# Altium project 2312_BadgePlaceTravail.PrjPcb (part 2 of 2)
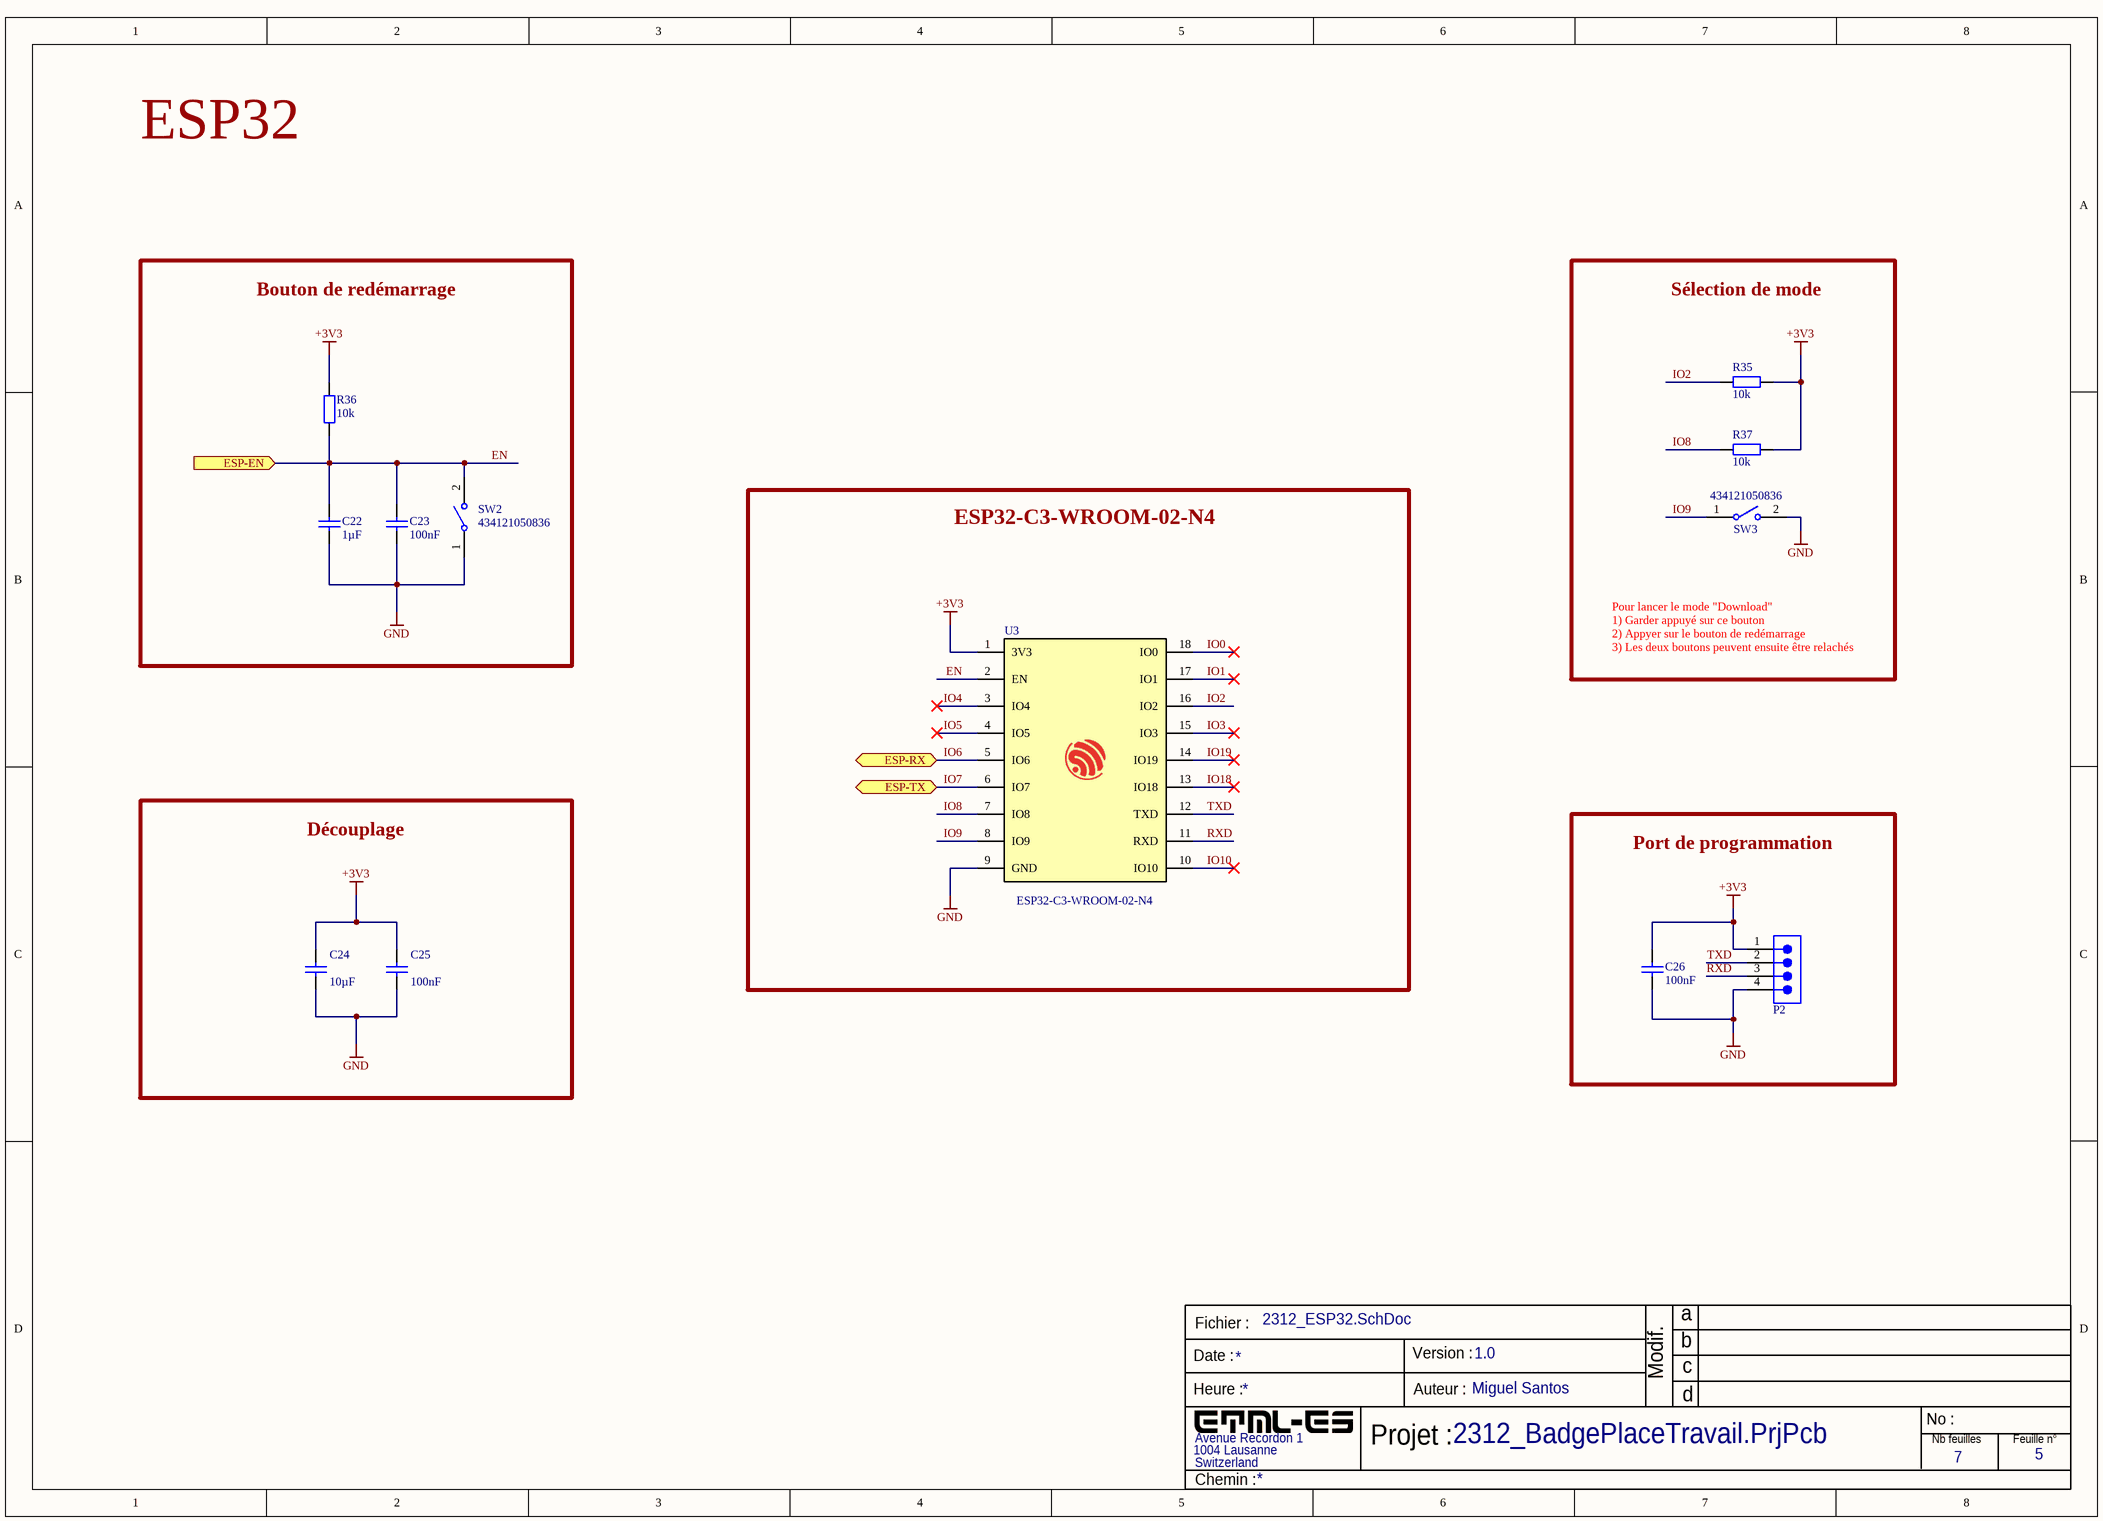
[diagram p7: 2312_ESP32.SchDoc]

## Nets that join several sheets
+3V3: 2312_SchemaBloc (P4.2 TP1.1), 2312_Puissance (5 pins), 2312_PIC32 (15 pins), 2312_Interface (11 pins), 2312_Ethernet (24 pins), 2312_RFID (C27.2 C28.2 MIKROBUS1.7 P3.1), 2312_ESP32 (8 pins)
GND: 2312_SchemaBloc (TP3.1 TP4.1), 2312_Puissance (7 pins), 2312_PIC32 (15 pins), 2312_Interface (13 pins), 2312_Ethernet (16 pins), 2312_RFID (5 pins), 2312_ESP32 (9 pins)
AC-RST: 2312_Puissance (R3.2), 2312_PIC32 (U1.58)
AC-SET: 2312_Puissance (R4.1), 2312_PIC32 (U1.59)
CHILLI-RX: 2312_SchemaBloc (P6.1), 2312_PIC32 (U1.32), 2312_RFID (P3.3)
CHILLI-TX: 2312_SchemaBloc (P6.2), 2312_PIC32 (U1.31), 2312_RFID (P3.2)
CRS_DV: 2312_PIC32 (U1.62), 2312_Ethernet (R26.2)
DEBUG: 2312_SchemaBloc (TP2.1), 2312_PIC32 (U1.8), 2312_Interface (R45.1)
EMDC: 2312_PIC32 (U1.30), 2312_Ethernet (U2.13)
EMDIO: 2312_PIC32 (U1.49), 2312_Ethernet (R13.1 U2.12)
EN: 2312_PIC32 (U1.53), 2312_ESP32 (5 pins)
EREF-CLK: 2312_PIC32 (U1.63), 2312_Ethernet (R34.1)
ERXD_0: 2312_PIC32 (U1.61), 2312_Ethernet (R24.2)
ERXD_1: 2312_PIC32 (U1.60), 2312_Ethernet (R25.2)
ERXERR: 2312_PIC32 (U1.64), 2312_Ethernet (R30.2 U2.10)
ETXD_0: 2312_PIC32 (U1.2), 2312_Ethernet (R18.2)
ETXD_1: 2312_PIC32 (U1.3), 2312_Ethernet (R23.2)
ETXEN: 2312_PIC32 (U1.1), 2312_Ethernet (R27.2)
INT4: 2312_PIC32 (U1.45), 2312_Ethernet (R14.1 U2.14)
IO6: 2312_SchemaBloc (P8.2), 2312_PIC32 (U1.50), 2312_ESP32 (U3.5)
IO7: 2312_SchemaBloc (P8.1), 2312_PIC32 (U1.51), 2312_ESP32 (U3.6)
MB-AN: 2312_SchemaBloc (P9.1), 2312_PIC32 (U1.13), 2312_RFID (MIKROBUS1.1)
MB-CS: 2312_SchemaBloc (P10.4), 2312_PIC32 (U1.14), 2312_RFID (MIKROBUS1.3)
MB-INT: 2312_SchemaBloc (P9.4), 2312_PIC32 (U1.11), 2312_RFID (MIKROBUS1.15)
MB-MISO: 2312_SchemaBloc (P10.2), 2312_PIC32 (U1.5), 2312_RFID (MIKROBUS1.5)
MB-MOSI: 2312_SchemaBloc (P10.1), 2312_PIC32 (U1.6), 2312_RFID (MIKROBUS1.6)
MB-PWM: 2312_SchemaBloc (P9.2), 2312_PIC32 (U1.12), 2312_RFID (MIKROBUS1.16)
MB-RST: 2312_SchemaBloc (P9.3), 2312_PIC32 (U1.17), 2312_RFID (MIKROBUS1.2)
MB-RX: 2312_SchemaBloc (P7.1), 2312_PIC32 (U1.29), 2312_RFID (MIKROBUS1.14)
MB-SCK: 2312_SchemaBloc (P10.3), 2312_PIC32 (U1.4), 2312_RFID (MIKROBUS1.4)
MB-SCL: 2312_SchemaBloc (P7.3), 2312_PIC32 (R10.2 U1.44), 2312_RFID (MIKROBUS1.12)
MB-SDA: 2312_SchemaBloc (P7.4), 2312_PIC32 (R9.1 U1.43), 2312_RFID (MIKROBUS1.11)
MB-TX: 2312_SchemaBloc (P7.2), 2312_PIC32 (U1.21), 2312_RFID (MIKROBUS1.13)
nRST: 2312_PIC32 (C11.1 R11.2 R12.1 SW1.2), 2312_Ethernet (U2.15)
OC1: 2312_SchemaBloc (P5.2), 2312_PIC32 (U1.46), 2312_Interface (U4.6)
OC5: 2312_SchemaBloc (P5.1), 2312_PIC32 (U1.52), 2312_Interface (R39.2)
VOUT: 2312_SchemaBloc (P4.1), 2312_Puissance (C1.1 C2.2 PS1.5)